# EAGLE design at25df321 (EAGLE 6.4)
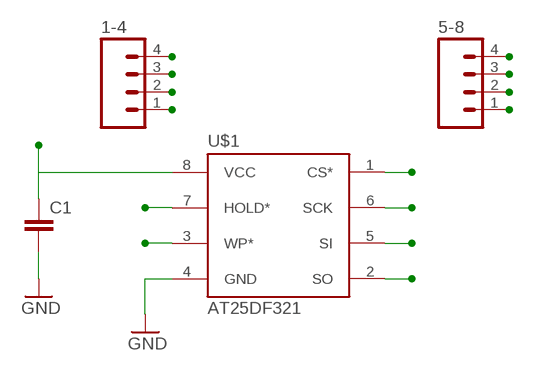
[diagram p0: schematic, sheet 1]

## Parts
1-4  M04PTH  [1X04]
5-8  M04PTH  [1X04]
C1  CAP1206  [1206]
U$1  AT25DF321  [WSOIC-8]

## Nets
CS*: 1-4.1 U$1.1(CS*)
GND: 1-4.4 C1.2 U$1.4(GND)
HOLD*: 5-8.3 U$1.7(HOLD*)
SCK: 5-8.2 U$1.6(SCK)
SI: 5-8.1 U$1.5(SI)
SO: 1-4.2 U$1.2(SO)
VCC: 5-8.4 C1.1 U$1.8(VCC)
WP*: 1-4.3 U$1.3(WP*)

## Library data of the parts
1-4 5-8 = SparkFun-Connectors:M04: Header 4 Standard 4-pin 0.1" header. Use with straight break away headers (SKU : PRT-00116), right angle break away headers (PRT-00553), swiss pins (PRT-00743), machine pins (PRT-00117), and female headers (PRT-00115). Molex polarized connector foot print use with SKU : PRT-08231 with associated crimp pins and housings. 1MM SMD Version SKU: PRT-10208
C1 = SparkFun:CAP: Capacitor Standard 0603 ceramic capacitor, and 0.1" leaded capacitor.
U$1 = Synapseware:AT25DF321

## Board
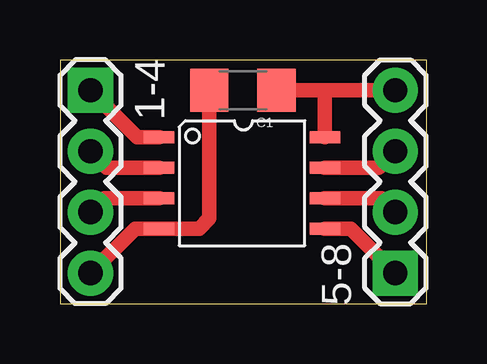
[diagram p1: board, top side]

Size 15.29 x 10.15 mm. Coordinates in mm from the lower left corner, seen from the top.
Outline: 0,0 15.29,0 15.29,10.15 0,10.15 0,0
Copper layers (1*16): Top 0.035mm / dielectric 1.5mm / Bottom 0.035mm
Design rules "default": minimum track width 16mil, minimum drill 24mil, track to track 8mil, track to pad 8mil, pad to pad 8mil, via to via 8mil, smd to smd 8mil, copper to edge 40mil, drill to drill 8mil, minimum pad ring 10mil, minimum via ring 8mil, stop-mask expansion 4mil, vias tented up to drill 0mil, thermal gap 10mil

### Footprints (pad centres in the part's own frame; a part is rotated, then mirrored left to right if it is on the bottom)
1X04 = drill 1.016 pad 1.88 square: 1 0,0 | drill 1.016 pad 1.88: 2 2.54,0; 3 5.08,0; 4 7.62,0
1206 = smd 1.6 x 1.8: 1 -1.4,0; 2 1.4,0
WSOIC-8 = smd 0.508 x 1.27: 1 -1.855,-3.486; 2 -0.585,-3.486; 3 0.685,-3.486; 4 1.955,-3.486; 5 1.955,3.413; 6 0.685,3.413; 7 -0.585,3.413; 8 -1.855,3.413

### Placement (x,y rotation side)
1-4  1.27,8.89 270 top
5-8  13.97,1.27 90 top
C1  7.62,8.89 180 top
U$1  7.62,5.08 270 top

### Tracks (layer width: path | path; a pad name or v marks a point on that pad's centre or on a via)
CS*
  Top 0.61: U$1.1 3.23,6.93 1-4.1
GND
  Top 0.61: C1.2 6.22,3.56 5.79,3.12 U$1.4 3.12,3.12 1-4.4
HOLD*
  Top 0.61: U$1.7 13.29,5.67 5-8.3
SCK
  Top 0.61: U$1.6 13.38,4.39 5-8.2
SI
  Top 0.61: U$1.5 12.12,3.12 5-8.1
SO
  Top 0.61: U$1.2 1.96,5.67 1-4.2
VCC
  Top 0.61: C1.1 11.18,8.89 | 11.18,8.89 5-8.4 | U$1.8 11.03,8.75 11.18,8.89
WP*
  Top 0.61: U$1.3 1.85,4.39 1-4.3